# Altium project M74R3.PrjPcb
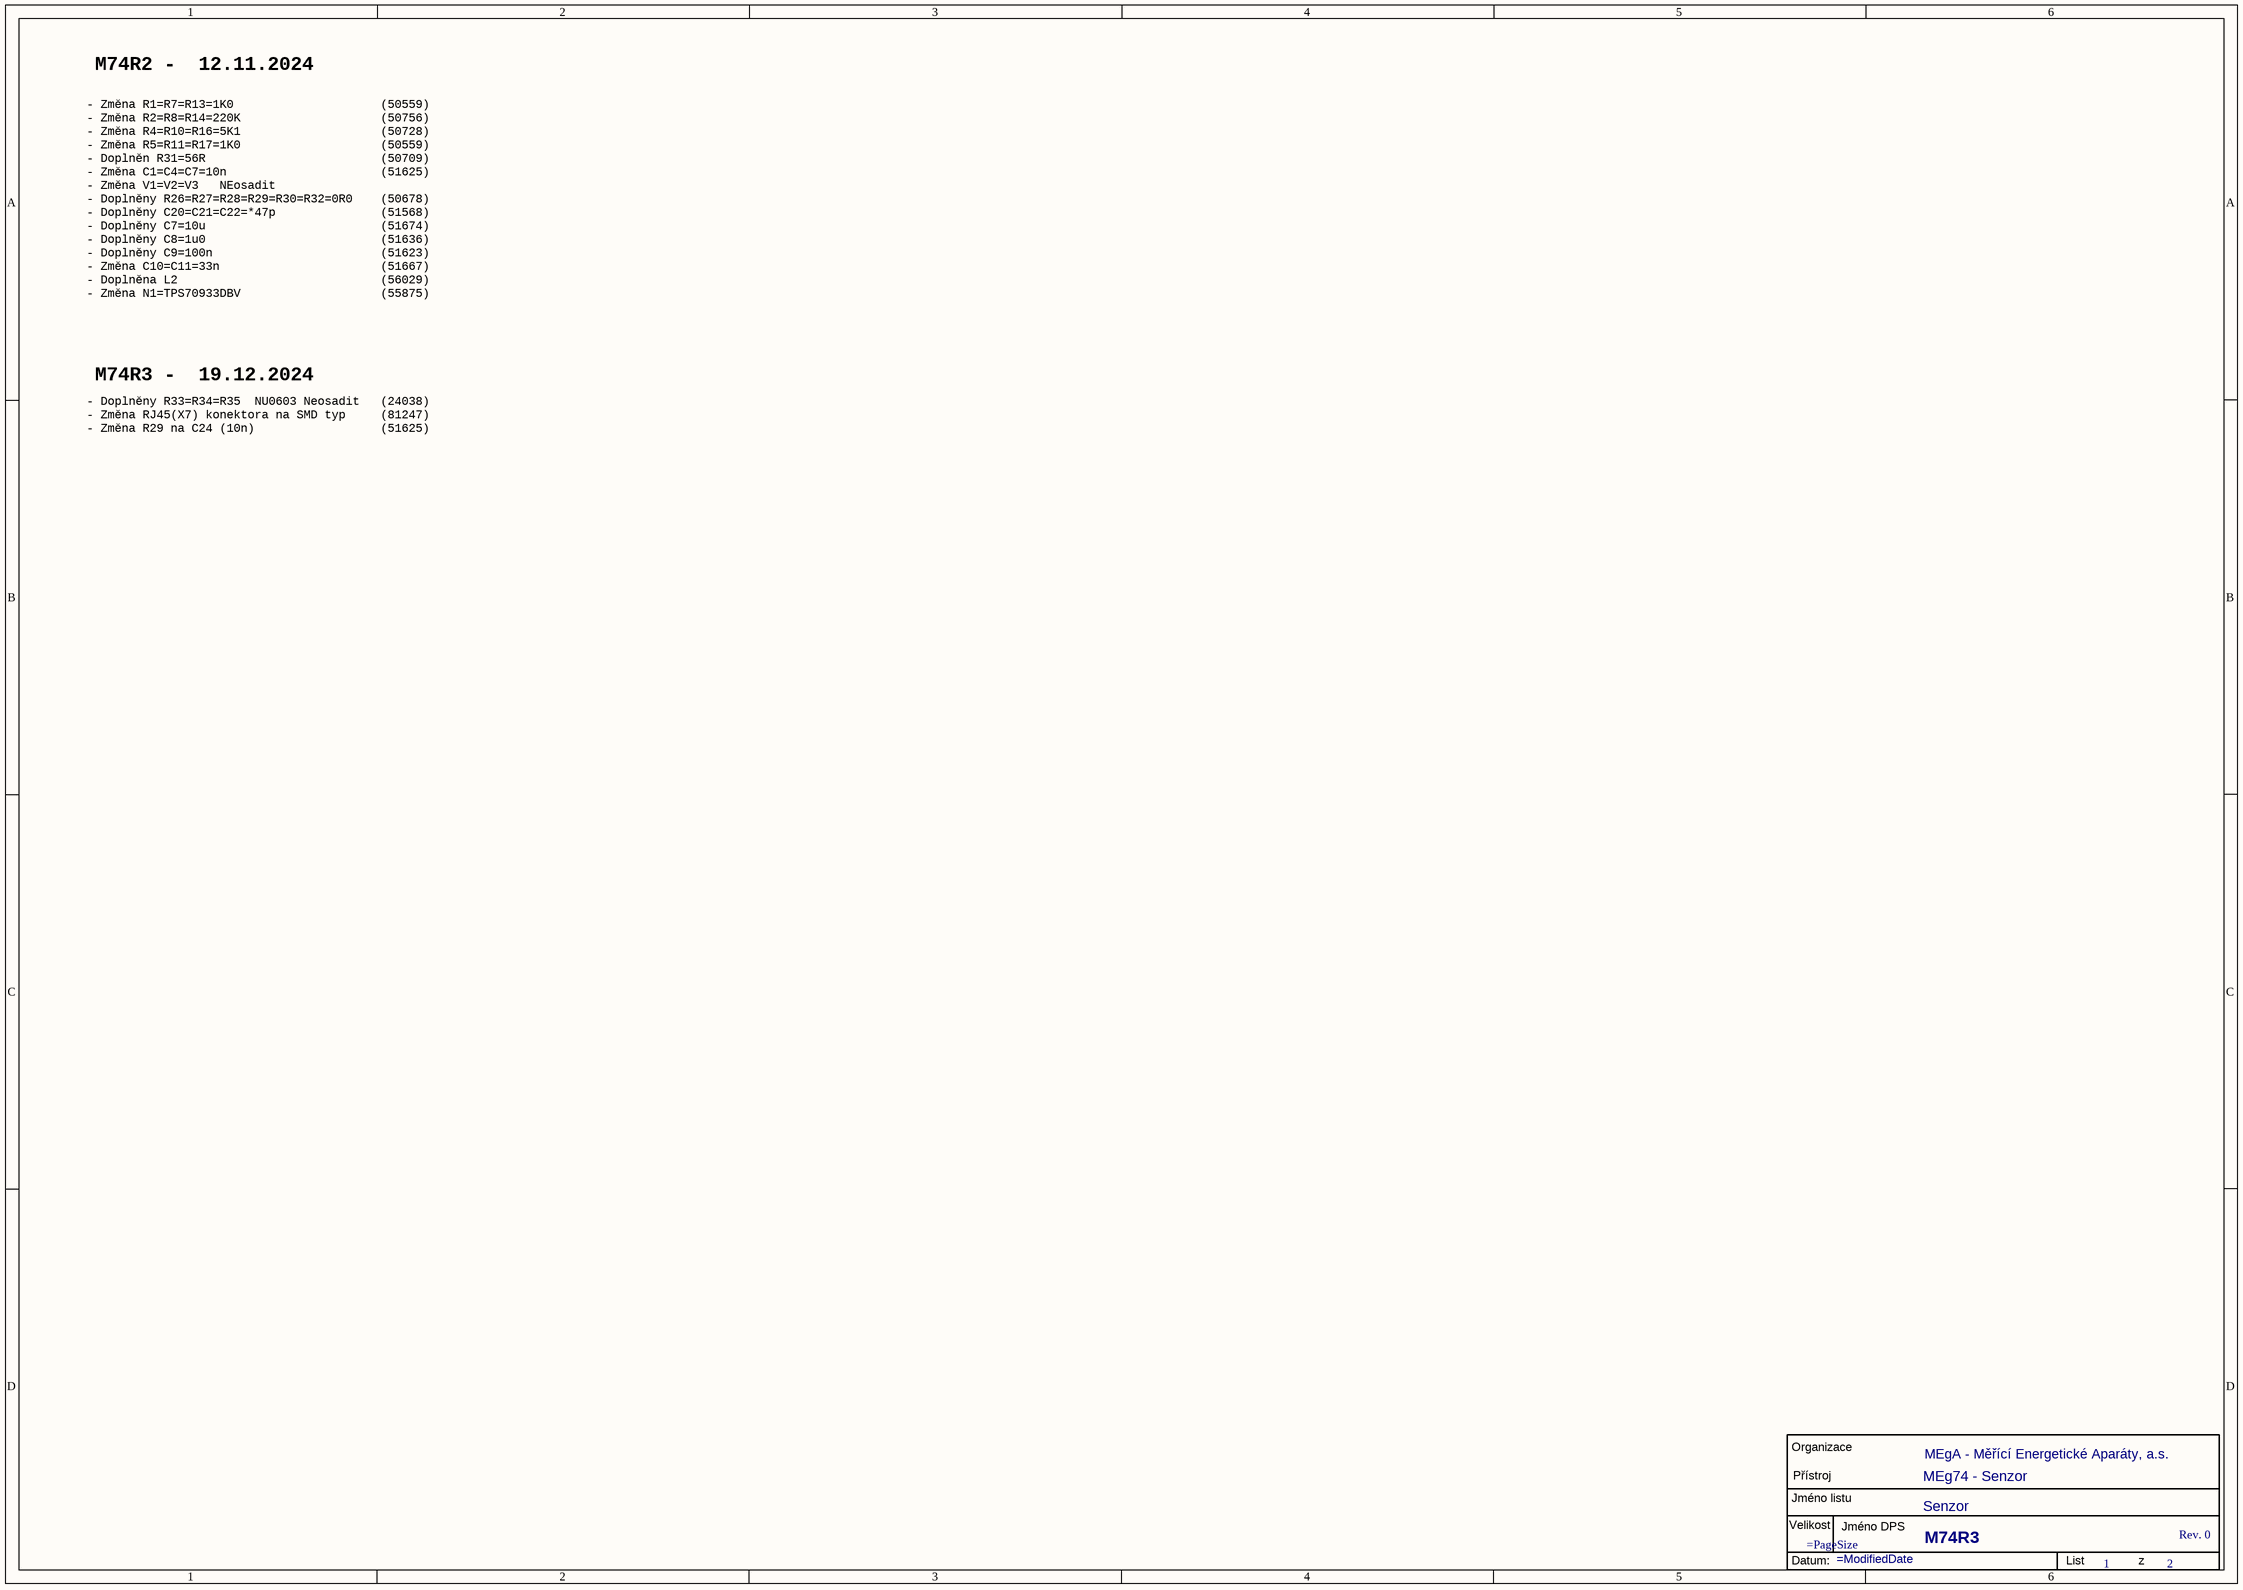
[diagram p0: L0 - Historie.SchDoc]
Organization: MEgA - Měřící Energetické Aparáty, a.s.
2 sheets, 82 parts. Net scope: global (net labels, ports and power ports of the same name join across sheets).
Board file: M74R3.PcbDoc
Sheets:
  L0 - Historie.SchDoc
  L1 - Roztrojeni.SchDoc

## Sheet L0 - Historie.SchDoc: Senzor
size 420 x 297 mm; Revision: Rev. 0; OrgName: MEgA - Měřící Energetické Aparáty, a.s.; Page Create Date: March  8, 1995; OrgAddr1: MEg74 - Senzor; Page Number: 1; Page Size: A3; Page Count: 2; Doc: M74R3; DsnPath: C:\Users\rtoth\Documents\GitHub\M74R\mega-original filesM74R2\M74R2.dsn; SchematicName: SCHEMATIC1; PageName: L0 - Historie; PageSize: A3; TopSchematic: True

### Parts
(Parts that share a designator on the sheet are numbered #1, #2 ... from top to bottom, then left to right.)
*#1  Page Count: 2  Page Number: 1  OrgAddr1: MEg74 - Senzor  OrgName: MEgA - Měřící Energetické Aparáty, a.s.  Title: Senzor  RevCode: Rev. 0  Doc: M74R3  (graphical)

### Notes on the sheet
- - Změna R1=R7=R13=1K0                     (50559)
- - Změna R2=R8=R14=220K                    (50756)
- M74R2 -  12.11.2024
- - Změna C1=C4=C7=10n                      (51625)
- - Změna V1=V2=V3   NEosadit
- - Změna R4=R10=R16=5K1                    (50728)
- - Změna R5=R11=R17=1K0                    (50559)
- - Doplněn R31=56R                         (50709)
- - Doplněny R26=R27=R28=R29=R30=R32=0R0    (50678)
- - Doplněny C20=C21=C22=*47p               (51568)
- - Doplněny C7=10u                         (51674)
- - Doplněny C8=1u0                         (51636)
- - Doplněny C9=100n                        (51623)
- - Změna C10=C11=33n                       (51667)
- - Doplněna L2                             (56029)
- - Změna N1=TPS70933DBV                    (55875)
- M74R3 -  19.12.2024
- - Doplněny R33=R34=R35  NU0603 Neosadit   (24038)
- - Změna RJ45(X7) konektora na SMD typ     (81247)
- - Změna R29 na C24 (10n)                  (51625)
- (in symbol RAZITKO) Organizace; Přístroj; Jméno listu; Velikost; Jméno DPS; Datum:; List; z

### Library data of the parts
*#1 = RAZITKO: Page Size: =PageSize; Page Create Date: March  8, 1995; Page Modify Date: =ModifiedDate

## Sheet L1 - Roztrojeni.SchDoc: Senzor
size 420 x 297 mm; Revision: Rev. 0; OrgName: MEgA - Měřící Energetické Aparáty, a.s.; Page Create Date: March  8, 1995; OrgAddr1: MEg74 - Senzor; Page Number: 2; Page Size: A3; Page Count: 2; Doc: M74R3; DsnPath: C:\Users\rtoth\Documents\GitHub\M74R\mega-original filesM74R2\M74R2.dsn; SchematicName: SCHEMATIC1; PageName: L1 - Roztrojeni; PageSize: A3; TopSchematic: True
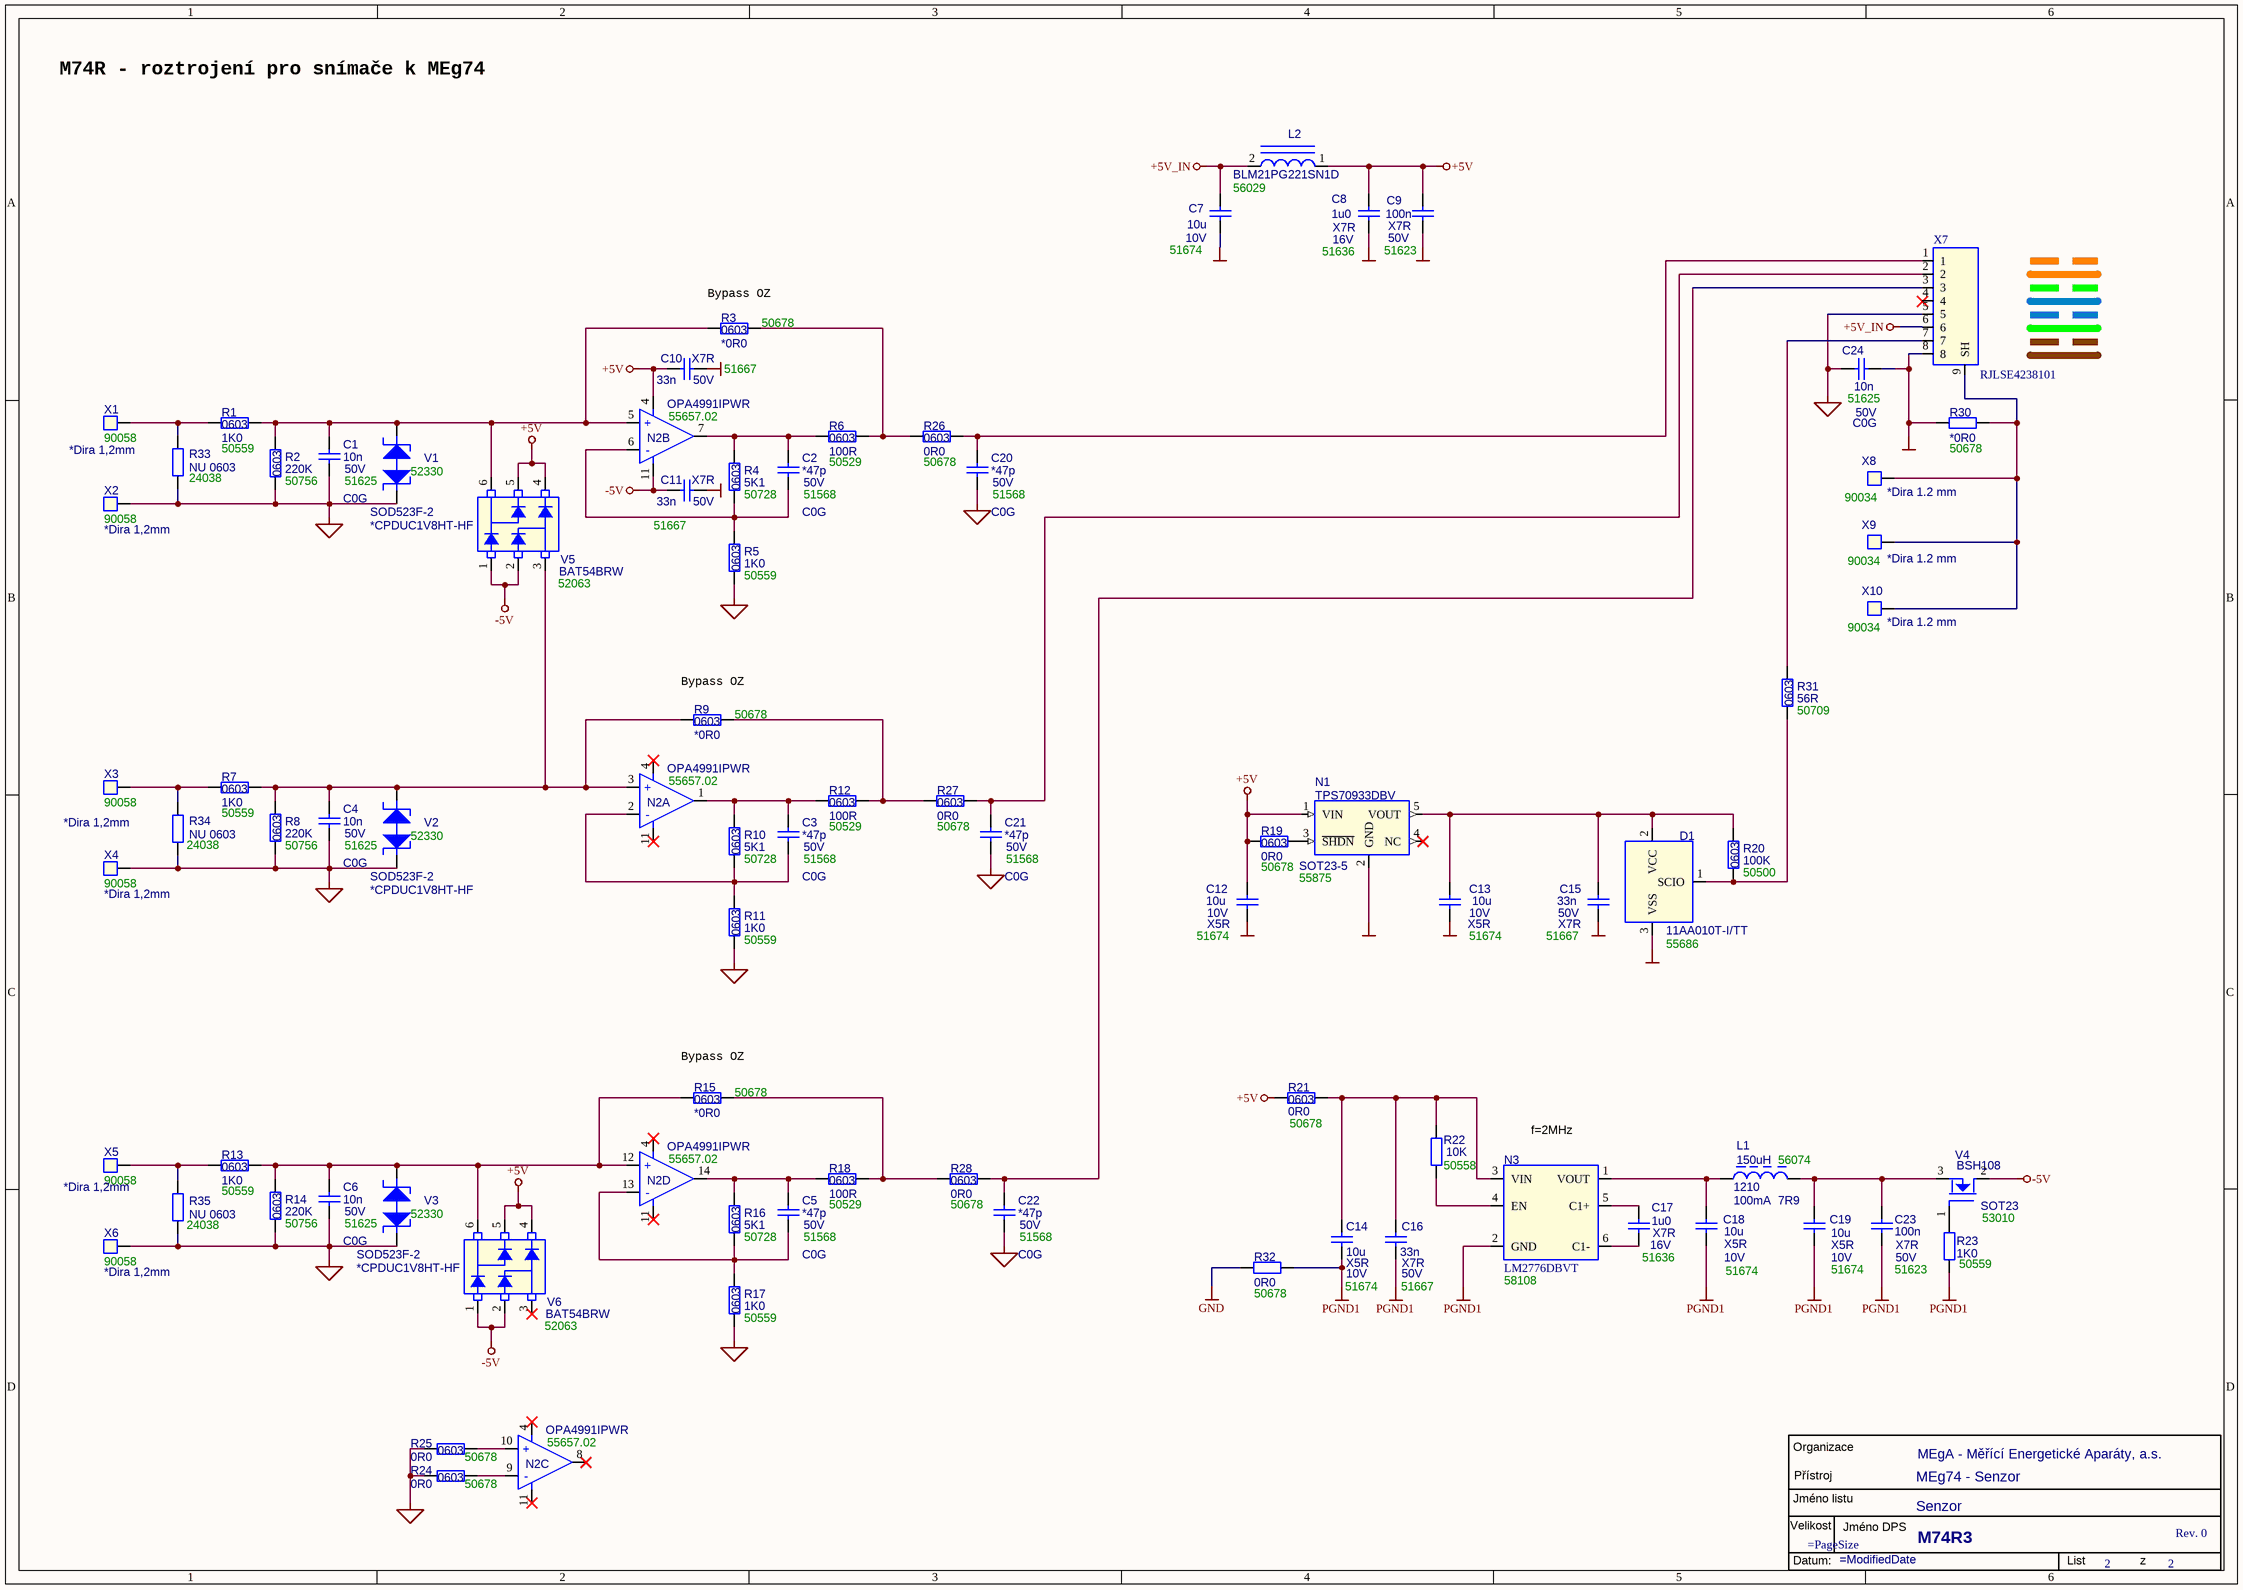
[diagram p1: L1 - Roztrojeni.SchDoc]

### Parts
(Parts that share a designator on the sheet are numbered #1, #2 ... from top to bottom, then left to right.)
*#2  Page Count: 2  OrgAddr1: MEg74 - Senzor  OrgName: MEgA - Měřící Energetické Aparáty, a.s.  Title: Senzor  RevCode: Rev. 0  Doc: M74R3  (graphical)
C1  10n  MEgA_ID: 51625  Tolerance: C0G  Voltage: 50V  [Z0603]
C2  *47p  MEgA_ID: 51568  Tolerance: C0G  Voltage: 50V  [Z0603]
C3  *47p  MEgA_ID: 51568  Tolerance: C0G  Voltage: 50V  [Z0603]
C4  10n  MEgA_ID: 51625  Tolerance: C0G  Voltage: 50V  [Z0603]
C5  *47p  MEgA_ID: 51568  Tolerance: C0G  Voltage: 50V  [Z0603]
C6  10n  MEgA_ID: 51625  Tolerance: C0G  Voltage: 50V  [Z0603]
C7  10u  MEgA_ID: 51674  Voltage: 10V  [Z0603]
C8  1u0  MEgA_ID: 51636  Tolerance: X7R  Voltage: 16V  [Z0603]
C9  100n  MEgA_ID: 51623  Tolerance: X7R  Voltage: 50V  [Z0603]
C10  33n  MEgA_ID: 51667  Tolerance: X7R  Voltage: 50V  [Z0603]
C11  33n  MEgA_ID: 51667  Tolerance: X7R  Voltage: 50V  [Z0603]
C12  10u  MEgA_ID: 51674  Tolerance: X5R  Voltage: 10V  [Z0603]
C13  10u  MEgA_ID: 51674  Tolerance: X5R  Voltage: 10V  [Z0603]
C14  10u  MEgA_ID: 51674  Tolerance: X5R  Voltage: 10V  [Z0603]
C15  33n  MEgA_ID: 51667  Tolerance: X7R  Voltage: 50V  [Z0603]
C16  33n  MEgA_ID: 51667  Tolerance: X7R  Voltage: 50V  [Z0603]
C17  1u0  MEgA_ID: 51636  Tolerance: X7R  Voltage: 16V  [Z0603]
C18  10u  MEgA_ID: 51674  Tolerance: X5R  Voltage: 10V  [Z0603]
C19  10u  MEgA_ID: 51674  Tolerance: X5R  Voltage: 10V  [Z0603]
C20  *47p  MEgA_ID: 51568  Tolerance: C0G  Voltage: 50V  [Z0603]
C21  *47p  MEgA_ID: 51568  Tolerance: C0G  Voltage: 50V  [Z0603]
C22  *47p  MEgA_ID: 51568  Tolerance: C0G  Voltage: 50V  [Z0603]
C23  100n  MEgA_ID: 51623  Tolerance: X7R  Voltage: 50V  [Z0603]
C24  10n  MEgA_ID: 51625  Tolerance: C0G  Voltage: 50V  [Z0603]
D1  11AA010T-I/TT  MEgA_ID: 55686  [ZSOT23A]
L1  150uH  MEGA_ID: 56074  Size: 1210  Power: 100mA  7R9  [Z1210]
L2  BLM21PG221SN1D  MEgA_ID: 56029  [Z0805]
N1  TPS70933DBV  MEgA_ID: 55875  Size: SOT23-5  [ZSOT23_5]
N2  OPA4991IPWR  MEGA_ID: 55657.02  [ZTSSOP14]  (parts A,B,C,D of 4)
N3  LM2776DBVT  MEgA_ID: 58108  [ZSOT23_6]
R1  1K0  Size: 0603  MEgA_ID: 50559  [Z0603]
R2  220K  Size: 0603  MEgA_ID: 50756  [Z0603]
R3  *0R0  Size: 0603  MEgA_ID: 50678  [Z0603]
R4  5K1  Size: 0603  MEgA_ID: 50728  [Z0603]
R5  1K0  Size: 0603  MEgA_ID: 50559  [Z0603]
R6  100R  Size: 0603  MEgA_ID: 50529  [Z0603]
R7  1K0  Size: 0603  MEgA_ID: 50559  [Z0603]
R8  220K  Size: 0603  MEgA_ID: 50756  [Z0603]
R9  *0R0  Size: 0603  MEgA_ID: 50678  [Z0603]
R10  5K1  Size: 0603  MEgA_ID: 50728  [Z0603]
R11  1K0  Size: 0603  MEgA_ID: 50559  [Z0603]
R12  100R  Size: 0603  MEgA_ID: 50529  [Z0603]
R13  1K0  Size: 0603  MEgA_ID: 50559  [Z0603]
R14  220K  Size: 0603  MEgA_ID: 50756  [Z0603]
R15  *0R0  Size: 0603  MEgA_ID: 50678  [Z0603]
R16  5K1  Size: 0603  MEgA_ID: 50728  [Z0603]
R17  1K0  Size: 0603  MEgA_ID: 50559  [Z0603]
R18  100R  Size: 0603  MEgA_ID: 50529  [Z0603]
R19  0R0  Size: 0603  MEgA_ID: 50678  [Z0603]
R20  100K  Size: 0603  MEgA_ID: 50500  [Z0603]
R21  0R0  Size: 0603  MEgA_ID: 50678  [Z0603]
R22  10K  MEgA_ID: 50558  [Z0603]
R23  1K0  MEgA_ID: 50559  [Z0603]
R24  0R0  Size: 0603  MEgA_ID: 50678  [Z0603]
R25  0R0  Size: 0603  MEgA_ID: 50678  [Z0603]
R26  0R0  Size: 0603  MEgA_ID: 50678  [Z0603]
R27  0R0  Size: 0603  MEgA_ID: 50678  [Z0603]
R28  0R0  Size: 0603  MEgA_ID: 50678  [Z0603]
R30  *0R0  MEgA_ID: 50678  [Z0603]
R31  56R  Size: 0603  MEgA_ID: 50709  [Z0603]
R32  0R0  MEgA_ID: 50678  [Z0603]
R33  NU 0603  MEgA_ID: 24038  [Z0603]
R34  NU 0603  MEgA_ID: 24038  [Z0603]
R35  NU 0603  MEgA_ID: 24038  [Z0603]
V1  *CPDUC1V8HT-HF  Size: SOD523F-2  MEGA_ID: 52330  [ZSOD523F]
V2  *CPDUC1V8HT-HF  Size: SOD523F-2  MEGA_ID: 52330  [ZSOD523F]
V3  *CPDUC1V8HT-HF  Size: SOD523F-2  MEGA_ID: 52330  [ZSOD523F]
V4  BSH108  MEGA_ID: 53010  Size: SOT23  [ZSOT23]
V5  BAT54BRW  MEgA_ID: 52063  [ZSOT363]
V6  BAT54BRW  MEgA_ID: 52063  [ZSOT363]
X1  *Dira 1,2mm  MEGA_ID: 90058  [HOLE_012_P_020x015]
X2  *Dira 1,2mm  MEGA_ID: 90058  [HOLE_012_P_020x015]
X3  *Dira 1,2mm  MEGA_ID: 90058  [HOLE_012_P_020x015]
X4  *Dira 1,2mm  MEGA_ID: 90058  [HOLE_012_P_020x015]
X5  *Dira 1,2mm  MEGA_ID: 90058  [HOLE_012_P_020x015]
X6  *Dira 1,2mm  MEGA_ID: 90058  [HOLE_012_P_020x015]
X7  RJLSE4238101  [RJLSE4238101]
X8  *Dira 1.2 mm  MEGA_ID: 90034  [HOLE_012_P_022]
X9  *Dira 1.2 mm  MEGA_ID: 90034  [HOLE_012_P_022]
X10  *Dira 1.2 mm  MEGA_ID: 90034  [HOLE_012_P_022]

### Nets
+5V: C8.1 C9.1 C10.1 C12.1 L2.1 N1.1(VIN) N2.4(V+) R19.1 R21.1 V5.4(K2) V5.5(K1) V6.4(K2) V6.5(K1)
+5V_IN: C7.1 L2.2 X7.6
-5V: C11.1 N2.11(V-) V4.2(D) V5.1(A1) V5.2(A2) V6.1(A1) V6.2(A2)
GND: C7.2 C8.2 C9.2 C10.2 C11.2 C12.2 C13.2 C15.2 C24.2 D1.3(VSS) N1.2(GND) R30.1 R32.1 X7.8
GNDSIG: C1.2 C4.2 C6.2 C20.2 C21.2 C22.2 C24.1 R2.2 R5.2 R8.2 R11.2 R14.2 R17.2 R24.1 R25.1 R33.1 R34.1 R35.1 V1.1(A) V2.1(A) V3.1(A) X2.1 X4.1 X6.1 X7.5
PGND1: C14.1 C16.1 C18.1 C19.1 C23.2 N3.2(GND) R23.1 R32.2
NetC1_1: C1.1 N2.5(IN+) R1.2 R2.1 R3.1 V1.2(K) V5.6(AK1)
NetC2_1: C2.1 N2.7(OUT) R4.1 R6.1
NetC2_2: C2.2 N2.6(IN-) R4.2 R5.1
NetC3_1: C3.1 N2.1(OUT) R10.1 R12.1
NetC3_2: C3.2 N2.2(IN-) R10.2 R11.1
NetC4_1: C4.1 N2.3(IN+) R7.2 R8.1 R9.1 V2.2(K) V5.3(AK2)
NetC5_1: C5.1 N2.14(OUT) R16.1 R18.1
NetC5_2: C5.2 N2.13(IN-) R16.2 R17.1
NetC6_1: C6.1 N2.12(IN+) R13.2 R14.1 R15.1 V3.2(K) V6.6(AK1)
NetC13_1: C13.1 C15.1 D1.2(VCC) N1.5(VOUT) R20.1
NetC14_2: C14.2 C16.2 N3.3(VIN) R21.2 R22.1
NetC17_1: C17.1 N3.6(C1-)
NetC17_2: C17.2 N3.5(C1+)
NetC18_2: C18.2 L1.1 N3.1(VOUT)
NetC19_2: C19.2 C23.1 L1.2 V4.3(S)
NetC20_1: C20.1 R26.2 X7.1
NetC21_1: C21.1 R27.2 X7.2
NetC22_1: C22.1 R28.2 X7.3
NetD1_1: D1.1(SCIO) R20.2 R31.2
NetN1_3: N1.3(~{SHDN}) R19.2
NetN2_9: N2.9(IN-) R24.2
NetN2_10: N2.10(IN+) R25.2
NetN3_4: N3.4(EN) R22.2
NetR1_1: R1.1 R33.2 X1.1
NetR3_2: R3.2 R6.2 R26.1
NetR7_1: R7.1 R34.2 X3.1
NetR9_2: R9.2 R12.2 R27.1
NetR13_1: R13.1 R35.2 X5.1
NetR15_2: R15.2 R18.2 R28.1
NetR23_2: R23.2 V4.1(G)
NetR30_2: R30.2 X7.9(SH) X8.1 X9.1 X10.1
NetR31_1: R31.1 X7.7

Not connected (* = marked no-connect by the designer): N1 4(NC)*; N2 8(OUT)*; V6 3(AK2)*; X7 4

### Notes on the sheet
- M74R - roztrojení pro snímače k MEg74
- (near R3) Bypass OZ
- (near R9) Bypass OZ
- (near R15) Bypass OZ
- (near N3) f=2MHz
- (in symbol AD824, part A) +; -
- (in symbol AD824, part B) +; -
- (in symbol AD824, part C) +; -
- (in symbol AD824, part D) +; -
- (in symbol RAZITKO) Organizace; Přístroj; Jméno listu; Velikost; Jméno DPS; Datum:; List; z

### Library data of the parts
*#2 = RAZITKO: Page Number: 2; Page Size: =PageSize; Page Create Date: March  8, 1995; Page Modify Date: =ModifiedDate
C1 = C: Part Reference: C1; Group: Proud I1; Assembled: Automat; Size: 0603; Value: 10n; PCB Footprint: Z0603
C2 = C: Part Reference: C2; Manufacturer: CL10C470JB8NNNC; Group: Proud I1; Assembled: Neosadit; Size: 0603; Value: *47p; PCB Footprint: Z0603
C3 = C: Part Reference: C3; Manufacturer: CL10C470JB8NNNC; Group: Proud I2; Assembled: Neosadit; Size: 0603; Value: *47p; PCB Footprint: Z0603
C4 = C: Part Reference: C4; Group: Proud I2; Assembled: Automat; Size: 0603; Value: 10n; PCB Footprint: Z0603
C5 = C: Part Reference: C5; Manufacturer: CL10C470JB8NNNC; Assembled: Neosadit; Group: Proud I3; Size: 0603; Value: *47p; PCB Footprint: Z0603
C6 = C: Part Reference: C6; Assembled: Automat; Group: Proud I3; Size: 0603; Value: 10n; PCB Footprint: Z0603
C7 = C: Part Reference: C7; Manufacturers part Reference: C0603C104K5RACTU; Tolerance: X5R; Assembled: Automat; Group: L6A - PLL; MAKE: Kemet; Size: 0603; Value: 10u; ROHS STATUS: COMPLIANT; TEMPERATURE GRADE: -55 to +125; TEMP Grade: -55 to +125; Package: 0603; PCB Footprint: Z0603
C8 = C: Part Reference: C8; Assembled: Automat; Group: L6A - PLL; Size: 0603; Value: 1u0; PCB Footprint: Z0603
C9 = C: Part Reference: C9; Assembled: Automat; Group: L6A - PLL; Size: 0603; Value: 100n; PCB Footprint: Z0603
C10 = C: Part Reference: C10; Group: Proud I1; Assembled: Automat; Size: 0603; Value: 33n; PCB Footprint: Z0603
C11 = C: Part Reference: C11; Assembled: Automat; Group: Proud I1; Size: 0603; Value: 33n; PCB Footprint: Z0603
C12 = C: Part Reference: C12; Assembled: Automat; Group: DC 3V3; Size: 0603; Value: 10u; PCB Footprint: Z0603
C13 = C: Part Reference: C13; Group: DC 3V3; Assembled: Automat; Size: 0603; Value: 10u; PCB Footprint: Z0603
C14 = C: Part Reference: C14; Group: Měnič +5V/-5V; Assembled: Automat; Size: 0603; Value: 10u; PCB Footprint: Z0603
C15 = C: Part Reference: C15; Group: DC 3V3; Assembled: Automat; Size: 0603; Value: 33n; PCB Footprint: Z0603
C16 = C: Part Reference: C16; Group: Měnič +5V/-5V; Assembled: Automat; Size: 0603; Value: 33n; PCB Footprint: Z0603
C17 = C: Part Reference: C17; Assembled: Automat; Group: Měnič +5V/-5V; Size: 0603; Value: 1u0; PCB Footprint: Z0603
C18 = C: Part Reference: C18; Group: Měnič +5V/-5V; Assembled: Automat; Size: 0603; Value: 10u; PCB Footprint: Z0603
C19 = C: Part Reference: C19; Assembled: Automat; Group: Měnič +5V/-5V; Size: 0603; Value: 10u; PCB Footprint: Z0603
C20 = C: Part Reference: C20; Manufacturer: CL10C470JB8NNNC; Group: Proud I1; Assembled: Neosadit; Size: 0603; Value: *47p; PCB Footprint: Z0603
C21 = C: Part Reference: C21; Manufacturer: CL10C470JB8NNNC; Assembled: Neosadit; Group: Proud I1; Size: 0603; Value: *47p; PCB Footprint: Z0603
C22 = C: Part Reference: C22; Manufacturer: CL10C470JB8NNNC; Group: Proud I1; Assembled: Neosadit; Size: 0603; Value: *47p; PCB Footprint: Z0603
C23 = C: Part Reference: C23; Assembled: Automat; Group: L6A - PLL; Size: 0603; Value: 100n; PCB Footprint: Z0603
C24 = C: Part Reference: C24; Group: Spojeni zemi; Assembled: Automat; Size: 0603; Value: 10n; PCB Footprint: Z0603
D1 = DIODE2_K_0: Part Reference: D1; Assembled: Automat; Group: Paměť; Value: 11AA010T-I/TT; PCB Footprint: ZSOT23A; Size: SOT23; Manufacturer: 11AA010T-I/TT
L1 = INDUCTOR: Part Reference: L1; Manufacturer: NLCV32T-151K-EF; Assembled: Automat; Group: Měnič +5V/-5V; Value: 150uH; PCB Footprint: Z1210
L2 = Ferrite Bead_0: Part Reference: L2; Group: L6A - PLL; Power: 2A 220R; Assembled: Automat; Value: BLM21PG221SN1D; PCB Footprint: Z0805; Size: 0805
N1 = MCP1801T_1: Part Reference: N1; Assembled: Automat; Power: 150 mA; Voltage: 3V3; Group: DC 3V3; Value: TPS70933DBV; PCB Footprint: ZSOT23_5
N2 = AD824: Part Reference: N2; Group: Proud I2; Voltage: 5...26V/2.7V...40V; Assembled: Automat; Size: TSSOP14; Value: OPA4991IPWR; Manufacturer: OPA4991IPWR; PCB Footprint: ZTSSOP14
N3 = LM2776_0: Part Reference: N3; Assembled: Automat; Power: 200mA; Voltage: 2V7...+5V; Group: Měnič +5V/-5V; Value: LM2776DBVT; Manufacturer: LM2776DBVT; Size: SOT23-6; PCB Footprint: ZSOT23_6
R1 = R: Part Reference: R1; Assembled: Automat; Power: 0.0625W; Voltage: 75V; Tolerance: 1%; Group: Proud I1; Value: 1K0; PCB Footprint: Z0603
R2 = R: Part Reference: R2; Manufacturer: RC0603FR-07220KL; Group: Proud I1; Tolerance: 1%; Voltage: 75V; Assembled: Automat; Value: 220K; PCB Footprint: Z0603
R3 = R: Part Reference: R3; Assembled: Neosadit; Power: 0.0625W max. 2A; Voltage: 75V; Tolerance: 1%; Group: Proud I1; Value: *0R0; PCB Footprint: Z0603
R4 = R: Part Reference: R4; Assembled: Automat; Voltage: 75V; Tolerance: 1%; Group: Proud I1; Value: 5K1; PCB Footprint: Z0603
R5 = R: Part Reference: R5; Tolerance: 1%; Voltage: 75V; Power: 0.0625W; Assembled: Automat; Group: Proud I1; Value: 1K0; PCB Footprint: Z0603
R6 = R: Part Reference: R6; Tolerance: 1%; Voltage: 75V; Power: 0.0625W; Assembled: Automat; Group: Proud I1; Value: 100R; PCB Footprint: Z0603
R7 = R: Part Reference: R7; Assembled: Automat; Power: 0.0625W; Voltage: 75V; Tolerance: 1%; Group: Proud I2; Value: 1K0; PCB Footprint: Z0603
R8 = R: Part Reference: R8; Manufacturer: RC0603FR-07220KL; Tolerance: 1%; Voltage: 75V; Assembled: Automat; Group: Proud I2; Value: 220K; PCB Footprint: Z0603
R9 = R: Part Reference: R9; Assembled: Neosadit; Power: 0.0625W max. 2A; Voltage: 75V; Tolerance: 1%; Group: Proud I2; Value: *0R0; PCB Footprint: Z0603
R10 = R: Part Reference: R10; Group: Proud I2; Tolerance: 1%; Voltage: 75V; Assembled: Automat; Value: 5K1; PCB Footprint: Z0603
R11 = R: Part Reference: R11; Group: Proud I2; Assembled: Automat; Power: 0.0625W; Voltage: 75V; Tolerance: 1%; Value: 1K0; PCB Footprint: Z0603
R12 = R: Part Reference: R12; Group: Proud I2; Assembled: Automat; Power: 0.0625W; Voltage: 75V; Tolerance: 1%; Value: 100R; PCB Footprint: Z0603
R13 = R: Part Reference: R13; Assembled: Automat; Power: 0.0625W; Voltage: 75V; Tolerance: 1%; Group: Proud I3; Value: 1K0; PCB Footprint: Z0603
R14 = R: Part Reference: R14; Manufacturer: RC0603FR-07220KL; Group: Proud I3; Assembled: Automat; Voltage: 75V; Tolerance: 1%; Value: 220K; PCB Footprint: Z0603
R15 = R: Part Reference: R15; Group: Proud I3; Tolerance: 1%; Voltage: 75V; Power: 0.0625W max. 2A; Assembled: Neosadit; Value: *0R0; PCB Footprint: Z0603
R16 = R: Part Reference: R16; Tolerance: 1%; Voltage: 75V; Assembled: Automat; Group: Proud I3; Value: 5K1; PCB Footprint: Z0603
R17 = R: Part Reference: R17; Assembled: Automat; Power: 0.0625W; Voltage: 75V; Tolerance: 1%; Group: Proud I3; Value: 1K0; PCB Footprint: Z0603
R18 = R: Part Reference: R18; Tolerance: 1%; Voltage: 75V; Power: 0.0625W; Assembled: Automat; Group: Proud I3; Value: 100R; PCB Footprint: Z0603
R19 = R: Part Reference: R19; Group: Proud I1; Assembled: Automat; Power: 0.0625W max. 2A; Voltage: 75V; Tolerance: 1%; Value: 0R0; PCB Footprint: Z0603
R20 = R: Part Reference: R20; Tolerance: 1%; Voltage: 75V; Power: 0.0625W; Assembled: Automat; Group: Paměť; Value: 100K; PCB Footprint: Z0603
R21 = R: Part Reference: R21; Assembled: Automat; Power: 0.0625W max. 2A; Voltage: 75V; Tolerance: 1%; Group: Měnič +5V/-5V; Value: 0R0; PCB Footprint: Z0603
R22 = R: Part Reference: R22; Assembled: Automat; Power: 0.0625W; Voltage: 75V; Tolerance: 1%; Group: Měnič +5V/-5V; Size: 0603; Value: 10K; PCB Footprint: Z0603
R23 = R: Part Reference: R23; Group: Měnič +5V/-5V; Tolerance: 1%; Voltage: 75V; Power: 0.0625W; Assembled: Automat; Size: 0603; Value: 1K0; PCB Footprint: Z0603
R24 = R: Part Reference: R24; Assembled: Automat; Power: 0.0625W max. 2A; Voltage: 75V; Tolerance: 1%; Value: 0R0; PCB Footprint: Z0603
R25 = R: Part Reference: R25; Assembled: Automat; Power: 0.0625W max. 2A; Voltage: 75V; Tolerance: 1%; Value: 0R0; PCB Footprint: Z0603
R26 = R: Part Reference: R26; Tolerance: 1%; Voltage: 75V; Power: 0.0625W max. 2A; Assembled: Automat; Group: Proud I1; Value: 0R0; PCB Footprint: Z0603
R27 = R: Part Reference: R27; Group: Proud I1; Assembled: Automat; Power: 0.0625W max. 2A; Voltage: 75V; Tolerance: 1%; Value: 0R0; PCB Footprint: Z0603
R28 = R: Part Reference: R28; Tolerance: 1%; Voltage: 75V; Power: 0.0625W max. 2A; Assembled: Automat; Group: Proud I1; Value: 0R0; PCB Footprint: Z0603
R30 = R: Part Reference: R30; Group: Proud I1; Assembled: Neosadit; Power: 0.0625W max. 2A; Voltage: 75V; Tolerance: 1%; Size: 0603; Value: *0R0; PCB Footprint: Z0603
R31 = R: Part Reference: R31; Tolerance: 1%; Voltage: 75V; Assembled: Automat; Group: Proud I2; Value: 56R; PCB Footprint: Z0603
R32 = R: Part Reference: R30; Group: Proud I1; Assembled: Automat; Power: 0.0625W max. 2A; Voltage: 75V; Tolerance: 1%; Size: 0603; Value: 0R0; PCB Footprint: Z0603
R33 = R: Part Reference: R33; Assembled: Neosadit; Power: 0.0625W; Voltage: 75V; Tolerance: 1%; Group: Proud I1; Size: 0603; Value: NU 0603; PCB Footprint: Z0603
R34 = R: Part Reference: R34; Assembled: Neosadit; Power: 0.0625W; Voltage: 75V; Tolerance: 1%; Group: Proud I2; Size: 0603; Value: NU 0603; PCB Footprint: Z0603
R35 = R: Part Reference: R35; Assembled: Neosadit; Power: 0.0625W; Voltage: 75V; Tolerance: 1%; Group: Proud I3; Size: 0603; Value: NU 0603; PCB Footprint: Z0603
V1 = TRANSIL_BI: Part Reference: V1; Group: Proud I1; Voltage: 1V8/2V3/8V; Power: 160W Bi 0.1uA; Assembled: Neosadit; Value: *CPDUC1V8HT-HF; PCB Footprint: ZSOD523F; Manufacturer: CPDUC1V8HT-HF
V2 = TRANSIL_BI: Part Reference: V2; Group: Proud I1; Voltage: 1V8/2V3/8V; Power: 160W Bi 0.1uA; Assembled: Neosadit; Value: *CPDUC1V8HT-HF; Manufacturer: CPDUC1V8HT-HF; PCB Footprint: ZSOD523F
V3 = TRANSIL_BI: Part Reference: V3; Group: Proud I1; Voltage: 1V8/2V3/8V; Power: 160W Bi 0.1uA; Assembled: Neosadit; Value: *CPDUC1V8HT-HF; Manufacturer: CPDUC1V8HT-HF; PCB Footprint: ZSOD523F
V4 = MOSFET N: Part Reference: V4; Power: 0.83W, Ic=1.2A; Assembled: Automat; Group: Měnič +5V/-5V; Voltage: Uds=30V,Ugs=20V; Value: BSH108; PCB Footprint: ZSOT23
V5 = DIODE2x2_AK_2: Part Reference: V5; Assembled: Automat; Power: 200mA; Voltage: 30V @1V; Group: L3 - Napeti; Value: BAT54BRW; Manufacturer: BAT54BRW; Size: SOT363; PCB Footprint: ZSOT363
V6 = DIODE2x2_AK_2: Part Reference: V6; Group: L3 - Napeti; Voltage: 30V @1V; Power: 200mA; Assembled: Automat; Value: BAT54BRW; Size: SOT363; Manufacturer: BAT54BRW; PCB Footprint: ZSOT363
X1 = SP1: I1; Part Reference: X1; PCB Footprint: HOLE_008_P_015; Assembled: Neosadit; Group: Proud I1; Value: *Dira 1,2mm; Size: d=2/1,5 mm
X2 = SP1: I1G; Part Reference: X2; PCB Footprint: HOLE_008_P_015; Assembled: Neosadit; Group: Proud I1; Value: *Dira 1,2mm; Size: d=2/1,5 mm
X3 = SP1: I2; Part Reference: X3; PCB Footprint: HOLE_008_P_015; Assembled: Neosadit; Group: Proud I2; Value: *Dira 1,2mm; Size: d=2/1,5 mm
X4 = SP1: I2G; Part Reference: X4; PCB Footprint: HOLE_008_P_015; Assembled: Neosadit; Group: Proud I2; Value: *Dira 1,2mm; Size: d=2/1,5 mm
X5 = SP1: I3; Part Reference: X5; PCB Footprint: HOLE_008_P_015; Assembled: Neosadit; Group: Proud I3; Value: *Dira 1,2mm; Size: d=2/1,5 mm
X6 = SP1: I3G; Part Reference: X6; PCB Footprint: HOLE_008_P_015; Assembled: Neosadit; Group: Proud I3; Value: *Dira 1,2mm; Size: d=2/1,5 mm
X7 = RJ45_Shielded: Part Reference: X7; PCB_Footprint: RJ45; MEGA_ID: 81250; Assembled: Automat; Size: RJ45; Value: RJLSE4238101; Voltage: *; Power: *; Tolerance: *; Manufacturer Part Number: RJLSE4238101
X8-X10 = SP1: SH; Part Reference: X8; Assembled: Neosadit; Value: *Dira 1.2 mm; Size: d=1.2/2.2 mm; PCB Footprint: HOLE_012_P_022

## Assembly variants
Aktivní s OZ - TOR 25A: not fitted C1 C2 C3 C4 C5 C6 C20 C21 C22 R3 R9 R15 R30 R33 R34 R35 V1 V2 V3
Aktivní s OZ - TOR 5A: not fitted C1 C2 C3 C4 C5 C6 C20 C21 C22 R3 R9 R15 R30 R33 R34 R35 V1 V2 V3
Aktivní s OZ - TOR 1A: not fitted C1 C2 C3 C4 C5 C6 C20 C21 C22 R3 R9 R15 R30 R33 R34 R35 V1 V2 V3
Aktivní s OZ - LCT10 25A: not fitted C1 C2 C3 C4 C5 C6 C20 C21 C22 R3 R9 R15 R30 R33 R34 R35 V1 V2 V3
Aktivní s OZ - LCT10 5A: not fitted C1 C2 C3 C4 C5 C6 C20 C21 C22 R3 R9 R15 R30 R33 R34 R35 V1 V2 V3
Aktivní s OZ - LCT10 1A: not fitted C1 C2 C3 C4 C5 C6 C20 C21 C22 R3 R9 R15 R30 R33 R34 R35 V1 V2 V3
Aktivní s OZ - AMOS 1000A: not fitted C2 C3 C5 C20 C21 C22 R3 R9 R15 R30 R33 R34 R35 V1 V2 V3
Aktivní s OZ - AMOS 600A: not fitted C2 C3 C5 C20 C21 C22 R3 R9 R15 R30 R33 R34 R35 V1 V2 V3
Aktivní s OZ - AMOS 200A: not fitted C2 C3 C5 C20 C21 C22 R3 R9 R15 R30 R33 R34 R35 V1 V2 V3
Aktivní s OZ - AMOS 300A: not fitted C2 C3 C5 C20 C21 C22 R3 R9 R15 R30 R33 R34 R35 V1 V2 V3
Aktivní s OZ - AMOS 100A: not fitted C2 C3 C5 C20 C21 C22 R3 R9 R15 R30 R33 R34 R35 V1 V2 V3
Pasivní bez OZ: not fitted C2 C3 C5 C10 C11 C14 C16 C17 C18 C19 C20 C21 C22 C23 L1 N2 N3 R4 R5 R6 R10 R11 R12 R16 R17 R18 R21 R22 R23 R24 R25 R30 R32 R33 R34 R35 V1 V2 V3 V4 V5 V6